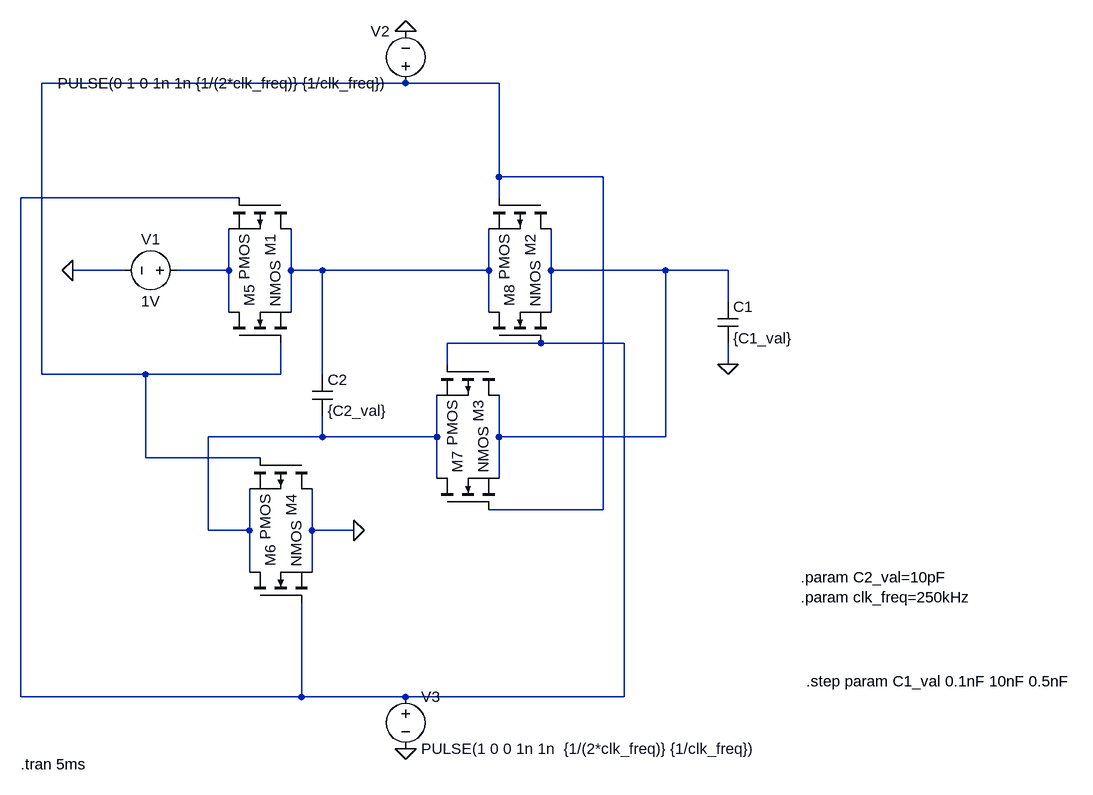
[diagram p0: schematic optimize_C1.asc]
optimize_C1.asc, the LTspice schematic file:
Version 4
SHEET 1 1112 1048
WIRE -64 -448 -624 -448
WIRE 80 -448 -64 -448
WIRE 80 -304 80 -448
WIRE 240 -304 80 -304
WIRE -320 -272 -656 -272
WIRE 80 -272 80 -304
WIRE -496 -160 -576 -160
WIRE -336 -160 -336 -224
WIRE -336 -160 -416 -160
WIRE -240 -160 -240 -224
WIRE -192 -160 -240 -160
WIRE 64 -160 64 -224
WIRE 64 -160 -192 -160
WIRE 160 -160 160 -224
WIRE 336 -160 160 -160
WIRE 432 -160 336 -160
WIRE 432 -112 432 -160
WIRE -336 -96 -336 -160
WIRE -240 -96 -240 -160
WIRE 64 -96 64 -160
WIRE 160 -96 160 -160
WIRE 144 -48 0 -48
WIRE 272 -48 144 -48
WIRE 0 -16 0 -48
WIRE 432 -16 432 -48
WIRE -624 0 -624 -448
WIRE -464 0 -624 0
WIRE -256 0 -256 -48
WIRE -256 0 -464 0
WIRE -192 0 -192 -160
WIRE -192 96 -192 64
WIRE -192 96 -368 96
WIRE -16 96 -16 32
WIRE -16 96 -192 96
WIRE 80 96 80 32
WIRE 336 96 336 -160
WIRE 336 96 80 96
WIRE -464 128 -464 0
WIRE -288 128 -464 128
WIRE -16 160 -16 96
WIRE 80 160 80 96
WIRE 240 208 240 -304
WIRE 240 208 64 208
WIRE -368 240 -368 96
WIRE -304 240 -304 176
WIRE -304 240 -368 240
WIRE -208 240 -208 176
WIRE -144 240 -208 240
WIRE -304 304 -304 240
WIRE -208 304 -208 240
WIRE -656 496 -656 -272
WIRE -224 496 -224 352
WIRE -224 496 -656 496
WIRE -64 496 -224 496
WIRE 272 496 272 -48
WIRE 272 496 -64 496
FLAG 432 -16 0
FLAG -144 240 0
FLAG -576 -160 0
FLAG -64 576 0
FLAG -64 -528 0
SYMBOL pmos -240 -272 R90
SYMATTR InstName M1
SYMBOL pmos 160 -272 R90
SYMATTR InstName M2
SYMBOL pmos 80 -16 R90
SYMATTR InstName M3
SYMBOL pmos -208 128 R90
SYMATTR InstName M4
SYMBOL nmos -336 -48 R270
SYMATTR InstName M5
SYMBOL nmos -304 352 R270
SYMATTR InstName M6
SYMBOL nmos -16 208 R270
SYMATTR InstName M7
SYMBOL nmos 64 -48 R270
SYMATTR InstName M8
SYMBOL cap 416 -112 R0
SYMATTR InstName C1
SYMATTR Value {C1_val}
SYMBOL cap -208 0 R0
SYMATTR InstName C2
SYMATTR Value {C2_val}
SYMBOL voltage -400 -160 R90
WINDOW 0 -32 56 VBottom 2
WINDOW 3 32 56 VTop 2
WINDOW 123 0 0 Left 0
WINDOW 39 0 0 Left 0
SYMATTR InstName V1
SYMATTR Value 1V
SYMBOL voltage -64 -432 R180
WINDOW 0 24 96 Left 2
WINDOW 3 24 16 Left 2
WINDOW 123 0 0 Left 0
WINDOW 39 0 0 Left 0
SYMATTR InstName V2
SYMATTR Value PULSE(0 1 0 1n 1n {1/(2*clk_freq)} {1/clk_freq})
SYMBOL voltage -64 480 R0
WINDOW 123 0 0 Left 0
WINDOW 39 0 0 Left 0
SYMATTR InstName V3
SYMATTR Value PULSE(1 0 0 1n 1n  {1/(2*clk_freq)} {1/clk_freq})
TEXT -656 600 Left 2 !.tran 5ms
TEXT 544 312 Left 2 !.param C2_val=10pF\n.param clk_freq=250kHz
TEXT 552 472 Left 2 !.step param C1_val 0.1nF 10nF 0.5nF

The netlist it stands for:
* optimize_C1.asc
M1 N004 N002 N003 N003 PMOS
M2 N005 N001 N004 N004 PMOS
M3 N005 N002 N006 N006 PMOS
M4 0 N001 N006 N006 PMOS
M5 N003 N001 N004 N004 NMOS
M6 N006 N002 0 0 NMOS
M7 N006 N001 N005 N005 NMOS
M8 N004 N002 N005 N005 NMOS
C1 N005 0 {C1_val}
C2 N004 N006 {C2_val}
V1 N003 0 1V
V2 N001 0 PULSE(0 1 0 1n 1n {1/(2*clk_freq)} {1/clk_freq})
V3 N002 0 PULSE(1 0 0 1n 1n  {1/(2*clk_freq)} {1/clk_freq})
.model NMOS NMOS
.model PMOS PMOS
.lib standard.mos
.tran 5ms
.param C2_val=10pF
.param clk_freq=250kHz
.step param C1_val 0.1nF 10nF 0.5nF
.backanno
.end